# Altium project STB_ControlBoard.PrjPcb (part 2 of 4)

## Sheet STB_USB.SchDoc: STB Control Board - USB
size A4; Author: mayerph; DrawnBy: mayerph; Organization: PBL; Revision: B; SheetNumber: 6; SheetTotal: 6
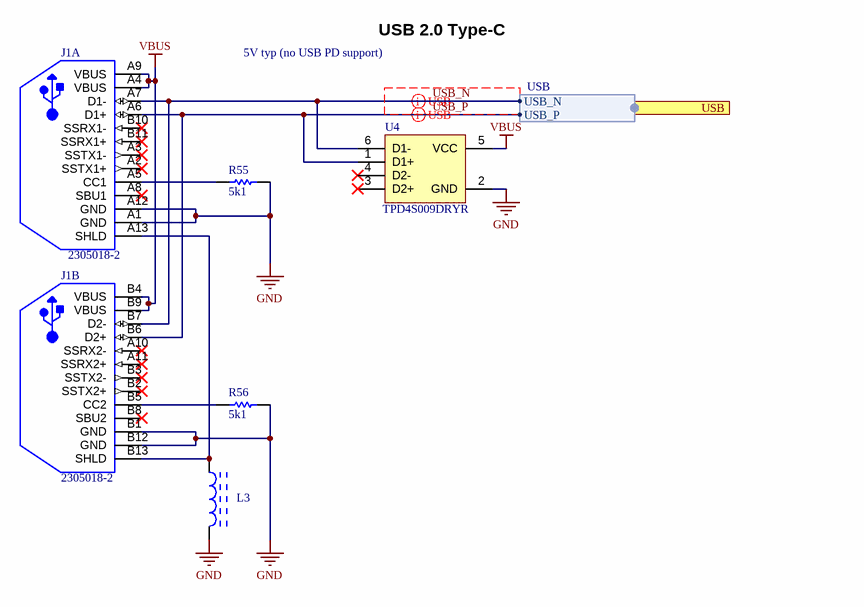
[diagram p1: STB_USB.SchDoc]

### Parts
J1  2305018-2  [2305018-2]  (parts A,B of 2)
L3  LI0402E300R-10  [INDC1005X07L]  (value not drawn)
R55  5k1  [RESC1005X40X25LL05T10]
R56  5k1  [RESC1005X40X25LL05T10]
U4  TPD4S009DRYR  [DRY0006A]

### Ports
USB (harness USB, see STB_ControlBoard[2A], STB_MCU[1A])

### Harnesses
USB: USB_N, USB_P

### Nets
GND: J1.A1(GND) J1.A12(GND) J1.B1(GND) J1.B12(GND) L3.2 R55.1 R56.1 U4.2(GND)
VBUS: J1.A4(VBUS) J1.A9(VBUS) J1.B4(VBUS) J1.B9(VBUS) U4.5(VCC)
USB_N: J1.A7(D1-) J1.B7(D2-) U4.6(D1-) ; port USB.USB_N
USB_P: J1.A6(D1+) J1.B6(D2+) U4.1(D1+) ; port USB.USB_P
NetJ1_A5: J1.A5(CC1) R55.2
NetJ1_A13: J1.A13(SHLD) J1.B13(SHLD) L3.1
NetJ1_B5: J1.B5(CC2) R56.2

Not connected (* = marked no-connect by the designer): J1 A2(SSTX1+)* A3(SSTX1-)* A8(SBU1)* A10(SSRX2-)* A11(SSRX2+)* B2(SSTX2+)* B3(SSTX2-)* B8(SBU2)* B10(SSRX1-)* B11(SSRX1+)*; U4 3(D2+)* 4(D2-)*

### Layout directives
differential pair; differential pair class USB_90R: USB_N, USB_P

### Notes on the sheet
- 5V typ (no USB PD support)
- USB 2.0 Type-C
- 1
- 2
- 3
- 4
- A
- B
- C
- Project:
- D
- Date:
- Drawing number:
- Rev:
- Format:
- A4 Q
- Drawn by:
- Laboratory:
- Page
- Sheet:
- of
- File:

### Library data of the parts
J1 = CMP-00966-1: USB TYPE C, REC IPX8 ON BOARD DUAL SMT; Manufacturer: TE Connectivity; Gender: Female; Number of Contacts: 24; Number of Ports: 1; Mounting Angle: Right Angle; IP Rating: IP67; Standard: USB; Termination Style: SMD/SMT; Mounting Style: Panel; Contact Plating: Gold; Type: C; Contact Material: Copper Alloy; Flammability Rating: UL 94 V-0; Shell Plating: Nickel; Manufacturer Part Number: 2305018-2; PartId: 1
L3 = CMP-00193-1: 30 Ohm 1 Power, Signal Line Ferrite Bead 0402 (1005 Metric) 500mA 300 mOhm Max DCR; Manufacturer: Laird-Signal Integrity Products; Number of Lines: 1; Impedance @ Frequency: 30 Ohm @ 100MHz; Packaging: Cut Tape (CT); Part Status: Active; Filter Type: Power, Signal Line; Current Rating (Max): 500mA; DC Resistance (DCR) (Max): 300 mOhm; Ratings: -; Operating Temperature: -40°C ~ 125°C; Package / Case: 0402 (1005 Metric); Mounting Type: Surface Mount; Manufacturer Part Number: LI0402E300R-10; Supplier: Digi-Key; Supplier Part Number: 240-2362-1-ND; ComponentLink1Description: Catalog_EMI%20Filtering%20&%20RF%20Inductors.pdf; ComponentLink1URL: http://cdn.lairdtech.com/home/brandworld/files/Catalog_EMI%20Filtering%20&%20RF%20Inductors.pdf
R55 R56 = CMP-2002-07753-1: Part Number: RC0402FR-075K1L; Manufacturer: Yageo / Phycomp; Tolerance: 1%; Rated Power Dissipation (P): 62.5mW; Value: 5.1 kOhm; Temperature Coefficient: 100ppm/°C; Working Voltage: 50V; Rated Temperature: 70°C; Additional Feature: LASER TRIMMABLE; Package Height: 0.35mm; Package Length: 1mm; Package Width: 0.5mm; Supplier 1: Digi-Key; Supplier Part Number 1: 311-5.10KLRDKR-ND; Manufacturer Part Number: RC0402FR-075K1L; RoHS: Yes; Category: Chip SMD Resistors; Stock 1: 2765402; Pricing 1: 1=0.10000, 10=0.01500, 100=0.00600, 1000=0.00267, 2500=0.00232, 5000=0.00192 (USD); Mount: Surface Mount; Number of Pins: 2; Package Shape: Rectangular; Size Code: 0402; Terminal Finish: Nickel; Min Operating Temperature: -55°C; Max Operating Temperature: 155°C; Resistor Type: FIXED RESISTOR; Technology: METAL GLAZE/THICK FILM; Termination: Wraparound; Packaging: Tape and Reel; Construction: Chip; Package Style: SMTMeter; JESD-609 Code: e3; REACH SVHC: Yes; RoHS Compliant: Yes; ComponentLink1URL: https://datasheet.ciiva.com:443/pdfs/VipMasterIC/IC/YAGO/YAGO-S-A0008145938/YAGO-S-A0008145938-1.pdf?src-supplier=IHS+Markit; ComponentLink1Description: https://datasheet.ciiva.com:443/pdfs/VipMasterIC/IC/YAGO/YAGO-S-A0008145938/YAGO-S-A0008145938-1.pdf?src-supplier=IHS+Markit; ComponentLink2URL: https://datasheet.ciiva.com/7983/1018594-7983519.pdf?src-supplier=Element14; ComponentLink2Description: https://datasheet.ciiva.com/7983/1018594-7983519.pdf?src-supplier=Element14; ComponentLink3URL: https://datasheet.ciiva.com/46394/1018594-46394936.pdf?src-supplier=Element14; ComponentLink3Description: https://datasheet.ciiva.com/46394/1018594-46394936.pdf?src-supplier=Element14; ComponentLink4URL: https://datasheet.ciiva.com/2453/pyu-r-int-thick-7-2453401.pdf?src-supplier=Digi-Key; ComponentLink4Description: https://datasheet.ciiva.com/2453/pyu-r-int-thick-7-2453401.pdf?src-supplier=Digi-Key; ComponentLink5URL: https://datasheet.ciiva.com/2453/pyu-r-int-thick-7-2453402.pdf?src-supplier=Digi-Key; ComponentLink5Description: https://datasheet.ciiva.com/2453/pyu-r-int-thick-7-2453402.pdf?src-supplier=Digi-Key; ComponentLink6URL: https://datasheet.ciiva.com/2453/pyu-r-int-thick-7-2453400.pdf?src-supplier=Digi-Key; ComponentLink6Description: https://datasheet.ciiva.com/2453/pyu-r-int-thick-7-2453400.pdf?src-supplier=Digi-Key; ComponentLink7URL: https://datasheet.ciiva.com/12558/pyu-rc0402-51-rohs-l-6-r-8721-12558460.pdf?src-supplier=Mouser; ComponentLink7Description: https://datasheet.ciiva.com/12558/pyu-rc0402-51-rohs-l-6-r-8721-12558460.pdf?src-supplier=Mouser; ComponentLink8URL: https://datasheet.ciiva.com/16744/pyu-rc0402-51-rohs-l-6-r-16744283.pdf?src-supplier=Future+Electronics; ComponentLink8Description: https://datasheet.ciiva.com/16744/pyu-rc0402-51-rohs-l-6-r-16744283.pdf?src-supplier=Future+Electronics; ComponentLink9URL: https://datasheet.ciiva.com/15189/getdatasheetpartid-323636-15189493.pdf?src-supplier=Verical; ComponentLink9Description: https://datasheet.ciiva.com/15189/getdatasheetpartid-323636-15189493.pdf?src-supplier=Verical
U4 = CMP-0326-00033-3: ESD Solution for High-Speed Differential Interface, 4 Channels, -40 to +85 degC, 6-pin SON (DRY), Green (RoHS & no Sb/Br); Manufacturer: Texas Instruments; Breakdown Voltage(Min)(V): 9; Differential Capacitance(pF): 0.05; IO Leakage Current(nA): Jan-00; IEC 61000-4-2 Contact(+/- kV): 8; IO Capacitance(Typ)(pF): 0.8; Direction: Unidirectional; Capacitance: 0.8pF; Number of Bidirectional Channels: 4; Reverse Standoff Voltage: 5.5V; Min Breakdown Voltage: 9V; Peak Pulse Power: 25W; Power Line Protection: Yes; Interface: LVDS,USB,Ethernet,HDMI,PCIe,SATA; Mounting Technology: Surface Mount; ComponentLink3URL: SamplesURL:http://www.ti.com/product/tpd4s009#samples; ComponentLink2URL: http://www.ti.com/general/docs/lit/getliterature.tsp?genericPartNumber=TPD4S009&fileType=pdf; ComponentLink1Description: Manufacturer URL; PackageDescription: 6-Pin Plastic Small Outline No-Lead, 1 x 1.45 x 0.6 mm Body, 0.5 mm Pitch; IEC 61000-4-2 Air-Gap(+/- kV): 9; Eco-Plan: Green (RoHS & no Sb/Br); PartNumber: TPD4S009DRYR; PackageReference: DRY0006A; DatasheetVersion: SLVS817E; ComponentLink3Description: URL Link1; SubFamily: ESD Solution; ComponentLink1URL: http://www.ti.com/; PackageVersion: revF, Dec-2011; ComponentLink2Description: Datasheet; Supplier 1: Digi-Key; Supplier Part Number 1: 296-23628-1-ND; Manufacturer Part Number: TPD4S009DRYR; RoHS: Yes; Category: Integrated Circuits (ICs); Stock 1: 8281; Pricing 1: 1=0.98000, 10=0.86400, 100=0.66240, 500=0.52364, 1000=0.41891, 2000=0.41249 (USD); Case/Package: SON; Number of Pins: 6; Contact Plating: Gold; Min Operating Temperature: -40°C; Max Operating Temperature: 85°C; Packaging: Tape and Reel; Package Quantity: 1; Breakdown Voltage: 9V; Working Voltage: 5.5V; Number of Unidirectional Channels: 4; Series: -; Length: 1.5mm; Depth: 1mm; Radiation Hardening: No; Lead Free: Lead Free; RoHS Compliant: Yes; ComponentLink4URL: https://datasheet.ciiva.com/15103/getdatasheetpartid-48198-15103810.pdf?src-supplier=Verical; ComponentLink4Description: https://datasheet.ciiva.com/15103/getdatasheetpartid-48198-15103810.pdf?src-supplier=Verical; ComponentLink5URL: https://datasheet.ciiva.com/339/tpd4s009-339414.pdf?src-supplier=Digi-Key; ComponentLink5Description: https://datasheet.ciiva.com/339/tpd4s009-339414.pdf?src-supplier=Digi-Key; ComponentLink6URL: https://datasheet.ciiva.com/339/tpd4s009-339415.pdf?src-supplier=Digi-Key; ComponentLink6Description: https://datasheet.ciiva.com/339/tpd4s009-339415.pdf?src-supplier=Digi-Key; ComponentLink7URL: https://datasheet.ciiva.com/339/tpd4s009-339416.pdf?src-supplier=Digi-Key; ComponentLink7Description: https://datasheet.ciiva.com/339/tpd4s009-339416.pdf?src-supplier=Digi-Key

## Sheet STB_PSU.SchDoc: STB Control Board - PSU
size A4; Author: mayerph; DrawnBy: mayerph; Organization: PBL; Revision: B; SheetNumber: 4; SheetTotal: 6
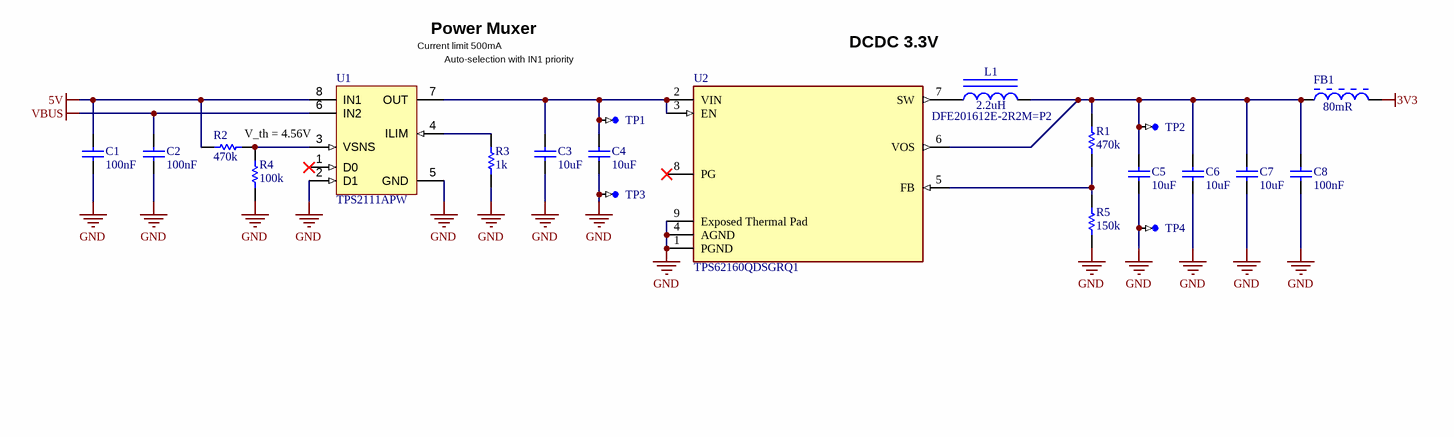
[diagram p2: STB_PSU.SchDoc]

### Parts
C1  100nF  [CAPC1050X55X23LL05T13]
C2  100nF  [CAPC1050X55X23LL05T13]
C3  10uF  [CAPC0603(1608)100_L]
C4  10uF  [CAPC0603(1608)100_L]
C5  10uF  [CAPC0603(1608)100_L]
C6  10uF  [CAPC0603(1608)100_L]
C7  10uF  [CAPC0603(1608)100_L]
C8  100nF  [CAPC1050X55X23LL05T13]
FB1  80mR  [MURA-BLM03-CHIP-2_V]
L1  DFE201612E-2R2M=P2  value 2.2uH  [INDC2016X10L]
R1  470k  [RESC1005X40X25LL05T10]
R2  470k  [RESC1005X40X25LL05T10]
R3  1k  [RESC1005X40X25LL05T10]
R4  100k  [RESC1005X40X25LL05T10]
R5  150k  [RESC1005X40X25LL05T05]
TP1  TP_1mm  [TP-SM-C-100]  (value not drawn)  (no BOM)
TP2  TP_1mm  [TP-SM-C-100]  (value not drawn)  (no BOM)
TP3  TP_1mm  [TP-SM-C-100]  (value not drawn)  (no BOM)
TP4  TP_1mm  [TP-SM-C-100]  (value not drawn)  (no BOM)
U1  TPS2111APW  [PW0008A_N]
U2  TPS62160QDSGRQ1  [FP-DSG0008A-IPC_C]

### Nets
3V3: FB1.2
5V: C1.2 R2.2 U1.8(IN1)
GND: C1.1 C2.1 C3.1 C4.1 C5.1 C6.1 C7.1 C8.1 R3.1 R4.2 R5.1 TP3.TP TP4.TP U1.2(D1) U1.5(GND) U2.1(PGND) U2.4(AGND) U2.9(Exposed_Thermal_Pad)
VBUS: C2.2 U1.6(IN2)
NetC3_2: C3.2 C4.2 TP1.TP U1.7(OUT) U2.2(VIN) U2.3(EN)
NetC5_2: C5.2 C6.2 C7.2 C8.2 FB1.1 L1.2 R1.1 TP2.TP U2.6(VOS)
NetL1_1: L1.1 U2.7(SW)
NetR1_2: R1.2 R5.2 U2.5(FB)
NetR2_1: R2.1 R4.1 U1.3(VSNS)
NetR3_2: R3.2 U1.4(ILIM)

Not connected (* = marked no-connect by the designer): U1 1(D0)*; U2 8(PG)*

### Notes on the sheet
- (near U1) Current limit 500mA
- Power Muxer
- (near U2) DCDC 3.3V
- (near U1) Auto-selection with IN1 priority
- (near R2) V_th = 4.56V
- 1
- 2
- 3
- 4
- A
- B
- C
- Project:
- D
- Date:
- Drawing number:
- Rev:
- Format:
- A4 Q
- Drawn by:
- Laboratory:
- Page
- Sheet:
- of
- File:

### Library data of the parts
C1 C2 C8 = CMP-2000-05439-1: Chip Capacitor, 100 nF, +/- 10%, 16 V, -55 to 125 degC, 0402 (1005 Metric), RoHS, Tape and Reel; Manufacturer: Samsung Electro-Mechanics; Manufacturer Part Number: CL05B104KO5NNNC; Dielectric: X7R; Rated Voltage: 16V; Dielectric Material: Ceramic; Multilayer: Yes; Case Size/Dimension: 0402; Tolerance (%): ±10%; Value: 100nF; Manufacturer URL: http://www.samsungsem.com/global/index.jsp; Datasheet URL: https://datasheet.ciiva.com/29198/458718-da-01-en-vs-kondensator-0402-29198423.pdf; Datasheet Version: Nov-10; Supplier 1: Digi-Key; Supplier Part Number 1: 1276-1001-6-ND; RoHS: Yes; Category: Ceramic Capacitors; Stock 1: 24854634; Pricing 1: 1=0.10000, 10=0.02400, 50=0.01300, 100=0.01050, 500=0.00752, 1000=0.00592, 2500=0.00538, 5000=0.00495 (USD); Mount: Surface Mount; Number of Pins: 2; Package Shape: Rectangular; Size Code: 0402; Terminal Finish: Nickel; Min Operating Temperature: -55°C; Max Operating Temperature: 125°C; JESD-609 Code: e3; Capacitor Type: Ceramic; Negative Tolerance: 10%; Packaging: Tape and Reel; Positive Tolerance: 10%; Rated DC Voltage (URdc): 16V; Temperature Characteristics Code: X7R; Termination: Wraparound; Package Style: SMTMeter; Length: 1mm; Width: 0.5mm; Height: 0.55mm; REACH SVHC: Yes; RoHS Compliant: Yes; ComponentLink1URL: https://datasheet.ciiva.com:443/pdfs/VipMasterIC/IC/SEMS/SEMS-S-A0008384515/SEMS-S-A0008872921-1.pdf?src-supplier=IHS+Markit; ComponentLink1Description: https://datasheet.ciiva.com:443/pdfs/VipMasterIC/IC/SEMS/SEMS-S-A0008384515/SEMS-S-A0008872921-1.pdf?src-supplier=IHS+Markit; ComponentLink2URL: https://datasheet.ciiva.com/26920/getdatasheetpartid-359683-26920169.pdf?src-supplier=Verical; ComponentLink2Description: https://datasheet.ciiva.com/26920/getdatasheetpartid-359683-26920169.pdf?src-supplier=Verical; ComponentLink3URL: https://datasheet.ciiva.com/29198/458718-da-01-en-vs-kondensator-0402-29198423.pdf?src-supplier=Conrad; ComponentLink3Description: https://datasheet.ciiva.com/29198/458718-da-01-en-vs-kondensator-0402-29198423.pdf?src-supplier=Conrad; ComponentLink4URL: https://datasheet.ciiva.com/26309/mlcc-catalogdownload2013-eng-26309003.pdf?src-supplier=Distrelec; ComponentLink4Description: https://datasheet.ciiva.com/26309/mlcc-catalogdownload2013-eng-26309003.pdf?src-supplier=Distrelec; ComponentLink5URL: https://datasheet.ciiva.com/16208/cl05b104kq5nnnc-16208343.pdf?src-supplier=Future+Electronics; ComponentLink5Description: https://datasheet.ciiva.com/16208/cl05b104kq5nnnc-16208343.pdf?src-supplier=Future+Electronics
C3-C7 = CMP-1035-02799-1: CAP 10uF 10V ±10% 0603 (1608 Metric) Thickness 1mm SMD; Manufacturer: Samsung; Manufacturer Part Number: CL10A106MP8NNNC; Tolerance: Â±10%; Case-Metric: 1608; Case-EIA: 0603; Dielectric: X5R; Max Thickness: 1 mm; Technology: SMT; Rated Voltage: 10 V; Value: 10uF; Supplier 1: Digi-Key; Supplier Part Number 1: 1276-1871-1-ND; RoHS: Yes; Category: Ceramic Capacitors; Stock 1: 643992; Pricing 1: 1=0.26000, 10=0.17600, 50=0.10580, 100=0.08930, 500=0.06112, 1000=0.05407 (USD); Mount: Surface Mount; Case/Package: 0603; Case Code (Imperial): 0603; Case Code (Metric): 1608; Contact Plating: Tin; Min Operating Temperature: -55°C; Max Operating Temperature: 85°C; Packaging: Tape and Reel; Capacitance: 10uF; Voltage Rating: 10V; Voltage Rating (DC): 10V; Package Quantity: 1; Length: 1.6mm; Width: 0.031inch; Height: 0.8mm; Thickness: 0.035inch; Depth: 0.8mm; Radiation Hardening: No; Lead Free: Lead Free; ComponentLink1URL: https://datasheet.ciiva.com/25793/cl10a106mp8nnnc-25793222.pdf?src-supplier=Digi-Key; ComponentLink1Description: https://datasheet.ciiva.com/25793/cl10a106mp8nnnc-25793222.pdf?src-supplier=Digi-Key; ComponentLink2URL: https://datasheet.ciiva.com/16200/cl10a106mp8nnnc-16200411.pdf?src-supplier=Future+Electronics; ComponentLink2Description: https://datasheet.ciiva.com/16200/cl10a106mp8nnnc-16200411.pdf?src-supplier=Future+Electronics; ComponentLink3URL: https://datasheet.ciiva.com/26946/getdatasheetpartid-357531-26946980.pdf?src-supplier=Verical; ComponentLink3Description: https://datasheet.ciiva.com/26946/getdatasheetpartid-357531-26946980.pdf?src-supplier=Verical
FB1 = CMP-0686-00058-2: Chip Ferrite Bead for Power lines and Signal Lines, 80 Ohm, 500 mA, -55 to 125 degC, 0.6 x 0.3 x 0.33 mm SMD, Tape and Reel; Manufacturer: Murata; PartNumber: BLM03AX800SN1D; DC Resistance: 0.18 Ohm Max.; Rated Current: 500 mA; Impedance (at 100 MHz): 80 Ohm +/- 25%; Material: Steel; Impedance: 80R; Current Rating: 500mA; DC Resistance (DCR): 180mR; Test Frequency: 100MHz; Tolerance: 25%; Number of Lines: 1; PackageReference: BLM03-2; ComponentLink2URL: http://www.murata.com/products/catalog/pdf/c31e.pdf; ComponentLink2Description: Datasheet; ComponentLink1Description: Manufacturer URL; DatasheetVersion: 08/2013; ComponentLink1URL: http://www.murata.com/; ComponentLink3Description: Package Specification; ComponentLink3URL: http://www.murata.com/products/catalog/pdf/c31e.pdf; PackageDescription: 2-Pin Chip, Body 0.6 x 0.3 mm; Packing: Tape and Reel; Operating Temperature Range: -55 to 125 degC; Mounting Technology: Surface Mount; Supplier 1: Digi-Key; Supplier Part Number 1: 490-5621-1-ND; Manufacturer Part Number: BLM03AX800SN1D; RoHS: Yes; Category: Inductors; Stock 1: 13310; Pricing 1: 1=0.19000, 10=0.15200, 25=0.11840, 50=0.09820, 100=0.08470, 250=0.06776, 500=0.06098, 1000=0.05082, 5000=0.04743 (USD); Case/Package: 0201; Number of Pins: 2; Case Code (Metric): 0603; Case Code (Imperial): 0201; Min Operating Temperature: -55°C; Max Operating Temperature: 125°C; Package Quantity: 1; Packaging: Tape and Reel; Max DC Current: 500mA; Termination: SMD/SMT; Max Current Rating: 500mA; Number of Circuits: 1; Length: 0.6mm; Height: 0.3mm; Width: 0.3mm; REACH SVHC: No SVHC; ComponentLink4URL: https://datasheet.ciiva.com/1013/l0110s0100blm03ax-1013986.pdf?src-supplier=Digi-Key; ComponentLink4Description: https://datasheet.ciiva.com/1013/l0110s0100blm03ax-1013986.pdf?src-supplier=Digi-Key; ComponentLink5URL: https://datasheet.ciiva.com/41449/001172131-da-01-en-drossel-0201-80r-0-6x0-3mm-15000st-41449422.pdf?src-supplier=Conrad; ComponentLink5Description: https://datasheet.ciiva.com/41449/001172131-da-01-en-drossel-0201-80r-0-6x0-3mm-15000st-41449422.pdf?src-supplier=Conrad; ComponentLink6URL: https://datasheet.ciiva.com/1013/l0110e-1013987.pdf?src-supplier=Digi-Key; ComponentLink6Description: https://datasheet.ciiva.com/1013/l0110e-1013987.pdf?src-supplier=Digi-Key; ComponentLink7URL: https://datasheet.ciiva.com/1013/l0110e-1013988.pdf?src-supplier=Digi-Key; ComponentLink7Description: https://datasheet.ciiva.com/1013/l0110e-1013988.pdf?src-supplier=Digi-Key; ComponentLink8URL: https://datasheet.ciiva.com/46423/1851884-46423882.pdf?src-supplier=Element14; ComponentLink8Description: https://datasheet.ciiva.com/46423/1851884-46423882.pdf?src-supplier=Element14
L1 = CMP-01651-1: 2.2µH Shielded Wirewound Inductor 1.8A 116mOhm Max 0806 (2016 Metric); Manufacturer: Murata Electronics; Inductance: 2,2µH; Current Rating (Amps): 1,8A; Tolerance: ±20%; Material - Core: Metal; Current - Saturation: 2.4A; Inductance Frequency - Test: 1MHz; DC Resistance (DCR): 116mOhm Max; Ratings: -; Series: DFE201612E; Operating Temperature: -40°C ~ 125°C; Features: -; Package / Case: 0806 (2016 Metric); Q @ Freq: -; Packaging: Tape & Reel (TR); Mounting Type: Surface Mount; Frequency - Self Resonant: -; Part Status: Active; Shielding: Shielded; Type: Wirewound; Supplier Device Package: 0806; Manufacturer Part Number: DFE201612E-2R2M=P2
R1 R2 = CMP-2002-07696-1: Part Number: RC0402FR-07470KL; Manufacturer: Yageo / Phycomp; Tolerance: 1%; Rated Power Dissipation (P): 62.5mW; Value: 470 kOhm; Temperature Coefficient: 100ppm/°C; Working Voltage: 50V; Rated Temperature: 70°C; Additional Feature: LASER TRIMMABLE; Package Height: 0.35mm; Package Length: 1mm; Package Width: 0.5mm; Supplier 1: Digi-Key; Supplier Part Number 1: 311-470KLRDKR-ND; Manufacturer Part Number: RC0402FR-07470KL; RoHS: Yes; Category: Chip SMD Resistors; Stock 1: 1650716; Pricing 1: 1=0.10000, 10=0.01500, 100=0.00600, 1000=0.00267, 2500=0.00232, 5000=0.00192 (USD); Mount: Surface Mount; Number of Pins: 2; Package Shape: Rectangular; Size Code: 0402; Terminal Finish: Nickel; Min Operating Temperature: -55°C; Max Operating Temperature: 155°C; JESD-609 Code: e3; Resistor Type: FIXED RESISTOR; Construction: Chip; Package Style: SMTMeter; Technology: METAL GLAZE/THICK FILM; Packaging: Tape and Reel; Termination: Wraparound; REACH SVHC: Yes; RoHS Compliant: Yes; ComponentLink1URL: https://datasheet.ciiva.com:443/pdfs/VipMasterIC/IC/YAGO/YAGO-S-A0008145938/YAGO-S-A0008145938-1.pdf?src-supplier=IHS+Markit; ComponentLink1Description: https://datasheet.ciiva.com:443/pdfs/VipMasterIC/IC/YAGO/YAGO-S-A0008145938/YAGO-S-A0008145938-1.pdf?src-supplier=IHS+Markit; ComponentLink2URL: https://datasheet.ciiva.com/11819/0900766b80c66297-11819514.pdf?src-supplier=RSComponents; ComponentLink2Description: https://datasheet.ciiva.com/11819/0900766b80c66297-11819514.pdf?src-supplier=RSComponents; ComponentLink3URL: https://datasheet.ciiva.com/46412/1018594-46412837.pdf?src-supplier=Element14; ComponentLink3Description: https://datasheet.ciiva.com/46412/1018594-46412837.pdf?src-supplier=Element14; ComponentLink4URL: https://datasheet.ciiva.com/2453/pyu-r-int-thick-7-2453434.pdf?src-supplier=Digi-Key; ComponentLink4Description: https://datasheet.ciiva.com/2453/pyu-r-int-thick-7-2453434.pdf?src-supplier=Digi-Key; ComponentLink5URL: https://datasheet.ciiva.com/2453/pyu-r-int-thick-7-2453435.pdf?src-supplier=Digi-Key; ComponentLink5Description: https://datasheet.ciiva.com/2453/pyu-r-int-thick-7-2453435.pdf?src-supplier=Digi-Key; ComponentLink6URL: https://datasheet.ciiva.com/2453/pyu-r-int-thick-7-2453433.pdf?src-supplier=Digi-Key; ComponentLink6Description: https://datasheet.ciiva.com/2453/pyu-r-int-thick-7-2453433.pdf?src-supplier=Digi-Key; ComponentLink7URL: https://datasheet.ciiva.com/7850/1018594-7850012.pdf?src-supplier=Element14; ComponentLink7Description: https://datasheet.ciiva.com/7850/1018594-7850012.pdf?src-supplier=Element14; ComponentLink8URL: https://datasheet.ciiva.com/7850/1018594-7850013.pdf?src-supplier=Element14; ComponentLink8Description: https://datasheet.ciiva.com/7850/1018594-7850013.pdf?src-supplier=Element14; ComponentLink9URL: https://datasheet.ciiva.com/15189/getdatasheetpartid-325138-15189462.pdf?src-supplier=Verical; ComponentLink9Description: https://datasheet.ciiva.com/15189/getdatasheetpartid-325138-15189462.pdf?src-supplier=Verical
R3 = CMP-2002-07472-1: Part Number: RC0402FR-071KL; Manufacturer: Yageo / Phycomp; Tolerance: 1%; Rated Power Dissipation (P): 62.5mW; Rated Temperature: 70°C; Value: 1 kOhm; Temperature Coefficient: 100ppm/°C; Working Voltage: 50V; Additional Feature: LASER TRIMMABLE; Package Height: 0.35mm; Package Length: 1mm; Package Width: 0.5mm; Supplier 1: Digi-Key; Supplier Part Number 1: 311-1.00KLRCT-ND; Manufacturer Part Number: RC0402FR-071KL; RoHS: Yes; Category: Chip SMD Resistors; Stock 1: 39605131; Pricing 1: 1=0.10000, 10=0.01500, 100=0.00600, 1000=0.00267, 2500=0.00232, 5000=0.00192 (USD); Mount: Surface Mount; Number of Pins: 2; Terminal Finish: Nickel; Size Code: 0402; Package Shape: Rectangular; Min Operating Temperature: -55°C; Max Operating Temperature: 155°C; JESD-609 Code: e3; Construction: Chip; Packaging: Tape and Reel; Resistor Type: FIXED RESISTOR; Technology: METAL GLAZE/THICK FILM; Termination: Wraparound; Package Style: SMTMeter; REACH SVHC: Yes; RoHS Compliant: Yes; ComponentLink1URL: https://datasheet.ciiva.com:443/pdfs/VipMasterIC/IC/YAGO/YAGO-S-A0008145938/YAGO-S-A0008145938-1.pdf?src-supplier=IHS+Markit; ComponentLink1Description: https://datasheet.ciiva.com:443/pdfs/VipMasterIC/IC/YAGO/YAGO-S-A0008145938/YAGO-S-A0008145938-1.pdf?src-supplier=IHS+Markit; ComponentLink2URL: http://www.farnell.com/datasheets/2167052.pdf?src-supplier=Newark; ComponentLink2Description: http://www.farnell.com/datasheets/2167052.pdf?src-supplier=Newark
R4 = CMP-2002-07343-1: Part Number: RC0402FR-07100KL; Manufacturer: Yageo / Phycomp; Tolerance: 1%; Rated Power Dissipation (P): 62.5mW; Rated Temperature: 70°C; Value: 100 kOhm; Temperature Coefficient: 100ppm/°C; Working Voltage: 50V; Additional Feature: LASER TRIMMABLE; Package Height: 0.35mm; Package Length: 1mm; Package Width: 0.5mm; Supplier 1: Digi-Key; Supplier Part Number 1: 311-100KLRDKR-ND; Manufacturer Part Number: RC0402FR-07100KL; RoHS: Yes; Category: Chip SMD Resistors; Stock 1: 43269933; Pricing 1: 1=0.10000, 10=0.01500, 100=0.00600, 1000=0.00267, 2500=0.00232, 5000=0.00192 (USD); Mount: Surface Mount; Number of Pins: 2; Size Code: 0402; Terminal Finish: Nickel; Package Shape: Rectangular; Min Operating Temperature: -55°C; Max Operating Temperature: 155°C; Resistor Type: FIXED RESISTOR; Technology: METAL GLAZE/THICK FILM; Termination: Wraparound; JESD-609 Code: e3; Construction: Chip; Package Style: SMTMeter; Packaging: Tape and Reel; REACH SVHC: Yes; RoHS Compliant: Yes; ComponentLink1URL: https://datasheet.ciiva.com:443/pdfs/VipMasterIC/IC/YAGO/YAGO-S-A0008145938/YAGO-S-A0008145938-1.pdf?src-supplier=IHS+Markit; ComponentLink1Description: https://datasheet.ciiva.com:443/pdfs/VipMasterIC/IC/YAGO/YAGO-S-A0008145938/YAGO-S-A0008145938-1.pdf?src-supplier=IHS+Markit
R5 = CMP-2002-08212-1: Manufacturer: Yageo; Manufacturer Part Number: RC0402FR-07150KL; Tolerance: 1%; Rated Power Dissipation (P): 62.5mW; Value: 150 kOhm; Temperature Coefficient: 100ppm/°C; Working Voltage: 50V; Rated Temperature: 70°C; Additional Feature: LASER TRIMMABLE; Package Height: 0.35mm; Package Length: 1mm; Package Width: 0.5mm; ComponentLink1URL: https://datasheet.ciiva.com:443/pdfs/VipMasterIC/IC/YAGO/YAGO-S-A0008145938/YAGO-S-A0008145938-1.pdf?src-supplier=IHS+Markit; ComponentLink1Description: https://datasheet.ciiva.com:443/pdfs/VipMasterIC/IC/YAGO/YAGO-S-A0008145938/YAGO-S-A0008145938-1.pdf?src-supplier=IHS+Markit; ComponentLink2URL: https://datasheet.ciiva.com/6067/1686128-6067913.pdf?src-supplier=Farnell; ComponentLink2Description: https://datasheet.ciiva.com/6067/1686128-6067913.pdf?src-supplier=Farnell; ComponentLink3URL: https://datasheet.ciiva.com/7983/1018594-7983494.pdf?src-supplier=Element14; ComponentLink3Description: https://datasheet.ciiva.com/7983/1018594-7983494.pdf?src-supplier=Element14; ComponentLink4URL: https://datasheet.ciiva.com/2453/pyu-r-int-thick-7-2453602.pdf?src-supplier=Digi-Key; ComponentLink4Description: https://datasheet.ciiva.com/2453/pyu-r-int-thick-7-2453602.pdf?src-supplier=Digi-Key; ComponentLink5URL: https://datasheet.ciiva.com/2453/pyu-r-int-thick-7-2453603.pdf?src-supplier=Digi-Key; ComponentLink5Description: https://datasheet.ciiva.com/2453/pyu-r-int-thick-7-2453603.pdf?src-supplier=Digi-Key; ComponentLink6URL: https://datasheet.ciiva.com/2453/pyu-r-int-thick-7-2453601.pdf?src-supplier=Digi-Key; ComponentLink6Description: https://datasheet.ciiva.com/2453/pyu-r-int-thick-7-2453601.pdf?src-supplier=Digi-Key; ComponentLink7URL: https://datasheet.ciiva.com/7849/1018594-7849837.pdf?src-supplier=Element14; ComponentLink7Description: https://datasheet.ciiva.com/7849/1018594-7849837.pdf?src-supplier=Element14; ComponentLink8URL: https://datasheet.ciiva.com/7849/1018594-7849836.pdf?src-supplier=Element14; ComponentLink8Description: https://datasheet.ciiva.com/7849/1018594-7849836.pdf?src-supplier=Element14; ComponentLink9URL: https://datasheet.ciiva.com/15189/getdatasheetpartid-326416-15189356.pdf?src-supplier=Verical; ComponentLink9Description: https://datasheet.ciiva.com/15189/getdatasheetpartid-326416-15189356.pdf?src-supplier=Verical; ComponentLink10URL: https://datasheet.ciiva.com/16741/pyu-rc0402-51-rohs-l-6-r-16741080.pdf?src-supplier=Future+Electronics; ComponentLink10Description: https://datasheet.ciiva.com/16741/pyu-rc0402-51-rohs-l-6-r-16741080.pdf?src-supplier=Future+Electronics; Supplier 1: Farnell; Supplier Part Number 1: 2693578; RoHS: Yes; Category: Chip SMD Resistors; Stock 1: 100000; Pricing 1: 10000=0.00110, 50000=0.00100 (CHF); Mount: Surface Mount; Number of Pins: 2; Package Shape: Rectangular; Size Code: 0402; Terminal Finish: Nickel; Min Operating Temperature: -55°C; Max Operating Temperature: 155°C; Resistor Type: FIXED RESISTOR; Construction: Chip; Package Style: SMTMeter; Technology: METAL GLAZE/THICK FILM; JESD-609 Code: e3; Packaging: Tape and Reel; Termination: Wraparound; REACH SVHC: Yes; RoHS Compliant: Yes
TP1-TP4 = testPoint_1mm: testPoint 1mm
U1 = CMP-0339-00041-2: Dual In / Single Out Autoswitching Power Mux, 2.8 to 5.5 V, -40 to 85 degC, 8-pin TSSOP (PW), Green (RoHS & no Sb/Br); Manufacturer: Texas Instruments; IN1, IN2 Input Voltage(Min)(V): 2.8; IN1 rDS(on)(Typ)(mOhm): 84; IN1, IN2 Input Voltage(Max)(V): 5.5; IN2 Output Current(Max)(A): 1.25; Number of Inputs: 2; IN2 rDS(on)(Typ)(Ohms): 0.084; SubFamily: Power Multiplexer (MUX); Package Body Material: Plastic; Adjustable Threshold: Yes; Analog IC - Other Type: POWER SUPPLY SUPPORT CIRCUIT; Number of Functions: 1; Package Equivalence Code: TSSOP8,.25; Power Supplies: 1.8/5V; Supply Current-Max (Isup): 90uA; Supply Voltage-Max (Vsup): 5.5V; Supply Voltage-Min (Vsup): 1.5V; Supply Voltage-Nom (Vsup): 2.8V; Qualification Status: Not Qualified; DatasheetVersion: SBVS043A; PackageDescription: 8-Pin Plastic Thin Small Outline Package 3 x 4.4 mm Body ,0.65 mm Pitch; Mounting Technology: Surface Mount; Code_JEDEC: MO-153; PartNumber: TPS2111APW; ComponentLink1URL: http://www.ti.com/general/docs/lit/getliterature.tsp?genericPartNumber=TPS2111A&fileType=pdf; Eco-Plan: Green (RoHS & no Sb/Br); IN1 Output Current(Max)(A): 1.25; ComponentLink1Description: Datasheet; PackageReference: PW0008A; PackageVersion: revG, Feb-2011; Supplier 1: Digi-Key; Supplier Part Number 1: 296-26917-5-ND; Manufacturer Part Number: TPS2111APW; RoHS: Yes; Category: Voltage Regulators - Switching; Stock 1: 630; Pricing 1: 1=2.94000, 10=2.63600, 25=2.49240, 100=2.16000, 250=2.04924, 500=1.83878, 1000=1.67200 (USD); Package Code: TSSOP; Number of Pins: 8; Package Shape: Rectangular; Terminal Finish: Nickel; Min Operating Temperature: -40°C; Max Operating Temperature: 85°C; JESD-609 Code: e4; JESD-30 Code: R-PDSO-G8; Moisture Sensitivity Level: 1; Number of Channels: 2; Package Style: SMALL OUTLINE, THIN PROFILE, SHRINK PITCHMeter; Peak Reflow Temperature (Cel): 260°C; Surface Mount: Yes; Terminal Form: Gull Wing; Terminal Position: DUAL; Length: 4.4mm; Width: 3mm; Height - Seated (Max): 1.2mm; Terminal Pitch: 0.65mm; Temperature Grade: INDUSTRIAL; REACH SVHC: Yes; RoHS Compliant: Yes; ComponentLink2URL: https://www.ti.com:443/lit/ds/symlink/tps2110a.pdf?src-supplier=IHS+Markit; ComponentLink2Description: https://www.ti.com:443/lit/ds/symlink/tps2110a.pdf?src-supplier=IHS+Markit; ComponentLink3URL: https://datasheet.ciiva.com/15109/getdatasheetpartid-172845-15109256.pdf?src-supplier=Verical; ComponentLink3Description: https://datasheet.ciiva.com/15109/getdatasheetpartid-172845-15109256.pdf?src-supplier=Verical; ComponentLink4URL: https://datasheet.ciiva.com/1961/tps2110a-1961047.pdf?src-supplier=Digi-Key; ComponentLink4Description: https://datasheet.ciiva.com/1961/tps2110a-1961047.pdf?src-supplier=Digi-Key; ComponentLink5URL: https://datasheet.ciiva.com/3232/tps2110a-3232453.pdf?src-supplier=Avnet; ComponentLink5Description: https://datasheet.ciiva.com/3232/tps2110a-3232453.pdf?src-supplier=Avnet
U2 = CMP-04918-000528-1: IC REG BUCK ADJUSTABLE 1A 8WSON; Manufacturer: Texas Instruments; Operating Supply Voltage: 17V; Min Input Voltage: 3V; Output Configuration: Positive; Switching Frequency: 2.25MHz; Min Output Voltage: 900mV; Max Output Voltage: 6V; Quiescent Current: 17uA; Number of Outputs: 1; Synchronous Rectifier: Yes; Package Body Material: Plastic; Analog IC - Other Type: SWITCHING REGULATOR; Control Technique: PULSE WIDTH MODULATION; Nominal Input Voltage: 12V; Length: 2mm; Weight: 0.000384oz; RoHS Compliant: Yes; Packaging: Tape and Reel; Max Output Current: 1A; Min Supply Voltage: 3V; Package Quantity: 3000; Contact Plating: Gold; Max Operating Temperature: 125°C; Mount: Surface Mount; Width: 2mm; Output Type: Adjustable; Min Operating Temperature: -40°C; Output Current: 1A; Max Input Voltage: 17V; Lead Free: Lead Free; Output Voltage: 6V; Height: 0.8mm; Number of Pins: 8; Supplier 1: Digi-Key; Supplier Part Number 1: 296-40840-1-ND; Manufacturer Part Number: TPS62160QDSGRQ1; RoHS: Yes; Category: Power Supply Modules; Package Code: HVSON; Package Shape: Square; Terminal Finish: Nickel; JESD-609 Code: e4; JESD-30 Code: S-PDSO-N8; Moisture Sensitivity Level: 2; Number of Functions: 1; Package Style: SMALL OUTLINE, HEAT SINK/SLUG, VERY THIN PROFILEMeter; Surface Mount: Yes; Switcher Configuration: BUCK; Switching Frequency-Max: 2.25MHz; Terminal Form: No Lead; Terminal Position: DUAL; Height - Seated (Max): 0.8mm; Terminal Pitch: 0.5mm; Temperature Grade: AUTOMOTIVE; REACH SVHC: Yes; ComponentLink1URL: https://www.ti.com:443/lit/ds/symlink/tps62160-q1.pdf?src-supplier=IHS+Markit; ComponentLink1Description: https://www.ti.com:443/lit/ds/symlink/tps62160-q1.pdf?src-supplier=IHS+Markit; ComponentLink2URL: http://www.ti.com/lit/ds/symlink/tps62160-q1.pdf?src-supplier=Digi-Key; ComponentLink2Description: http://www.ti.com/lit/ds/symlink/tps62160-q1.pdf?src-supplier=Digi-Key; ComponentLink3URL: http://www.ti.com/lit/gpn/tps62160-q1?src-supplier=Mouser; ComponentLink3Description: http://www.ti.com/lit/gpn/tps62160-q1?src-supplier=Mouser; ComponentLink4URL: http://www.ti.com/general/docs/lit/getliterature.tsp?genericPartNumber=TPS62160-Q1&&fileType=pdf&src-supplier=Avnet; ComponentLink4Description: http://www.ti.com/general/docs/lit/getliterature.tsp?genericPartNumber=TPS62160-Q1&&fileType=pdf&src-supplier=Avnet